# Altium schematic sheet ECUCheater.SCHDOC
size B
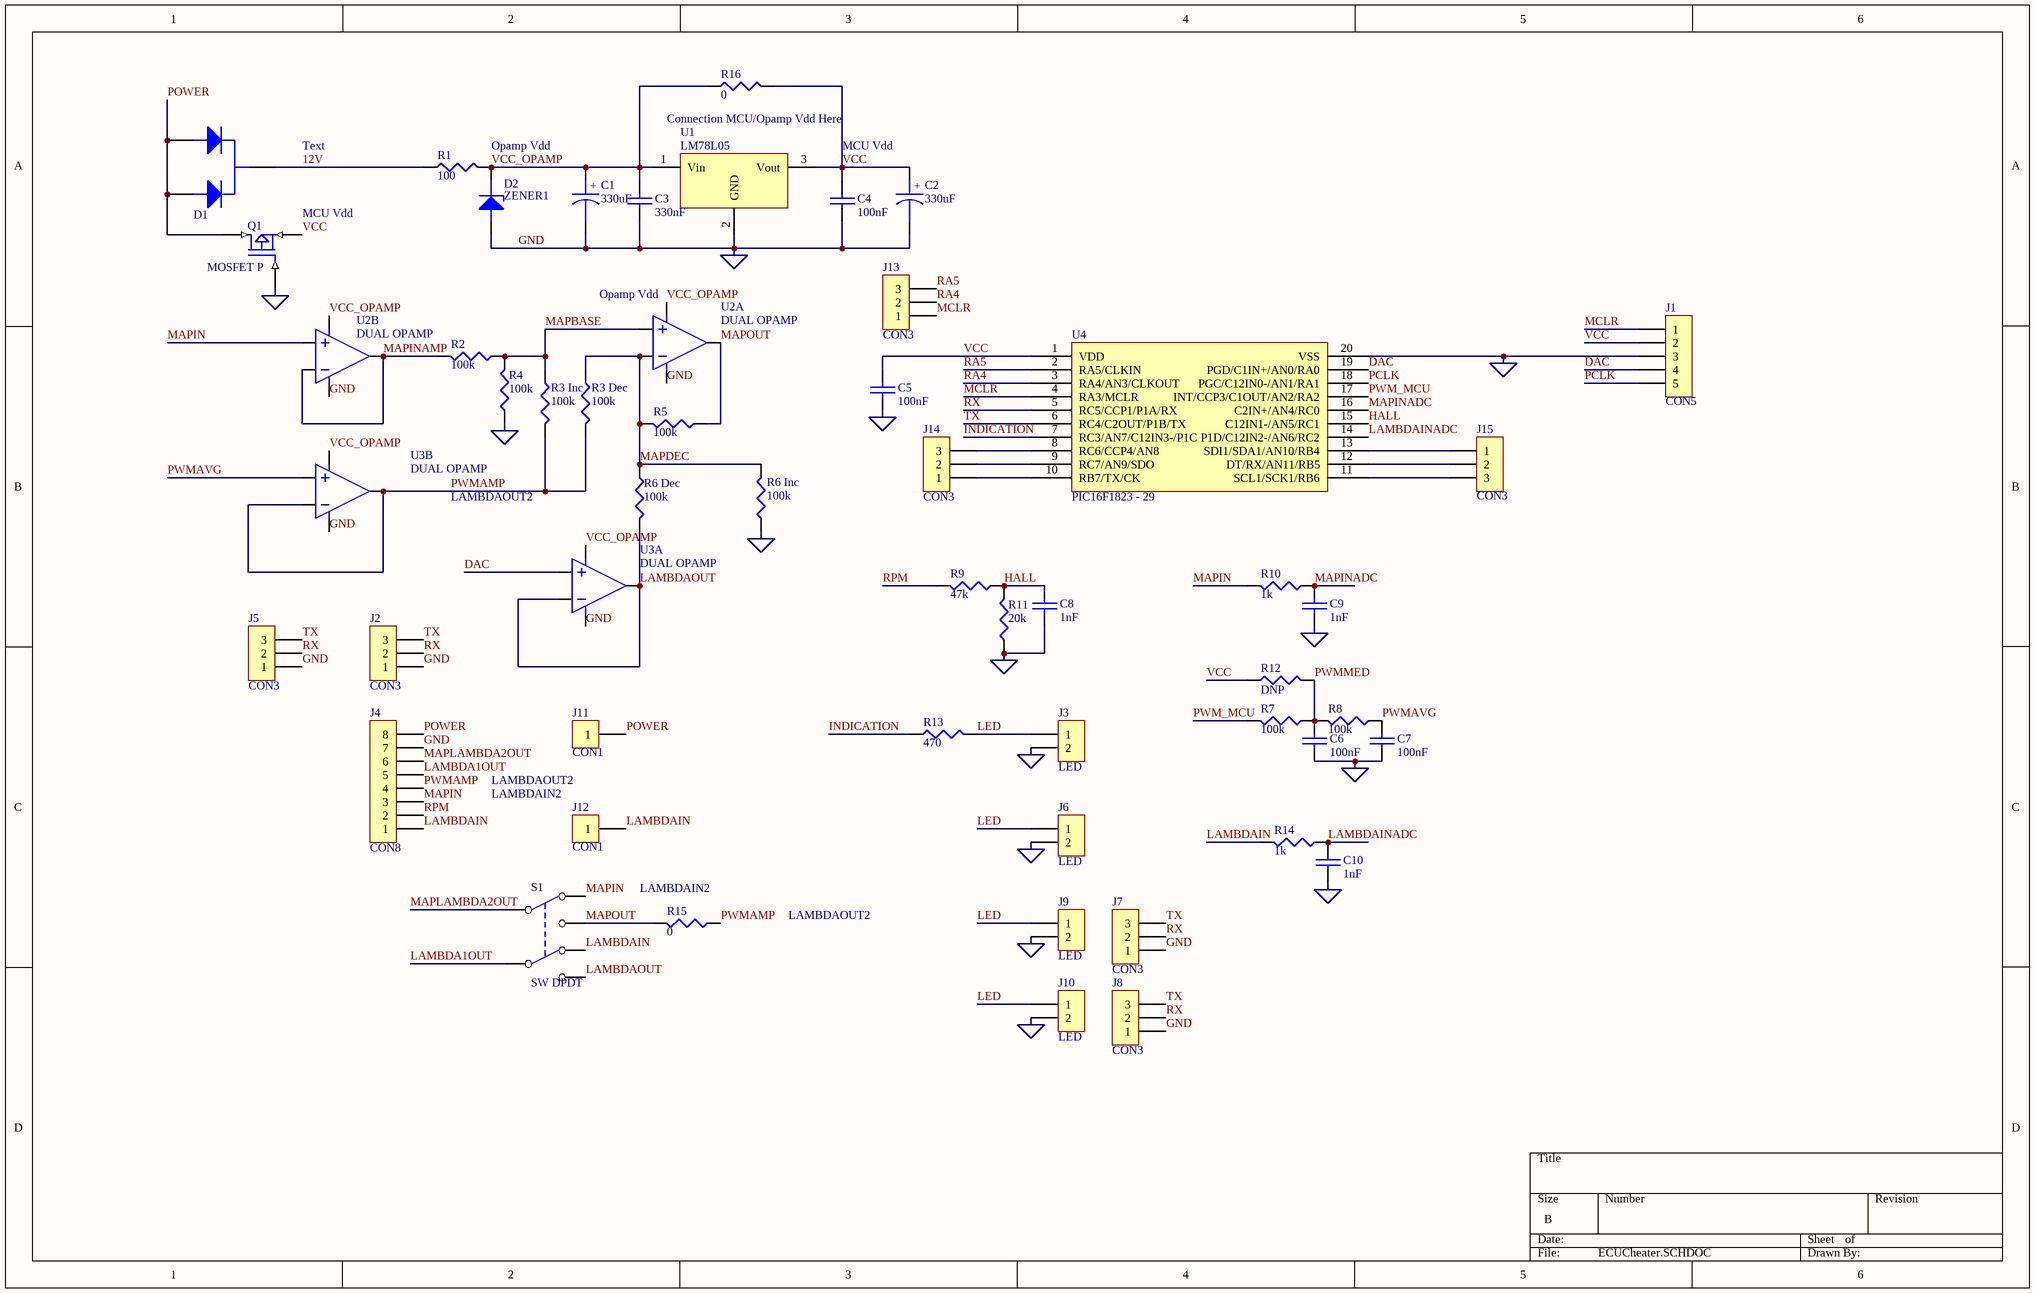
[diagram p0: ECUCheater.SCHDOC]

## Parts
C1  330uF  [3528 + RA 6.3mm NOT ROUND]
C2  330uF  [3528 + RA 6.3mm NOT ROUND]
C3  330nF  [0805]
C4  100nF  [0805]
C5  100nF  [0603 CAP]
C6  100nF  [0603 CAP]
C7  100nF  [0603 CAP]
C8  1nF  [0603 CAP]
C9  1nF  [0603 CAP]
C10  1nF  [0603 CAP]
D1  DUAL DIODE BAV70  [SOT-23]  (value not drawn)
D2  ZENER1  [SOT-23]
J1  CON5  [SIP5 - PGM]
J2  CON3  [SIP3]
J3  LED  [SIP2]
J4  CON8  [HD-351 8P]
J5  CON3  [SIP3]
J6  LED  [SIP2]
J7  CON3  [SIP3]
J8  CON3  [SIP3]
J9  LED  [SIP2]
J10  LED  [SIP2]
J11  CON1  [HD-351 1P]
J12  CON1  [HD-351 1P]
J13  CON3  [SIP3]
J14  CON3  [SIP3]
J15  CON3  [SIP3]
Q1  MOSFET P  [SOT-23]
R1  100  [0805]
R2  100k  [0603 RES]
R3_Dec  100k  [0603 RES]
R3_Inc  100k  [0603 RES]
R4  100k  [0603 RES]
R5  100k  [0603 RES]
R6_Dec  100k  [0603 RES]
R6_Inc  100k  [0603 RES]
R7  100k  [0603 RES]
R8  100k  [0603 RES]
R9  47k  [0603 RES]
R10  1k  [0603 RES]
R11  20k  [0603 RES]
R12  DNP  [0603 RES]
R13  470  [0603 RES]
R14  1k  [0603 RES]
R15  0  [0603 RES]
R16  0  [0805]
S1  SW DPDT  [BTN P1 ZIPPO]
U1  LM78L05  [SO-8 VOLTREG]
U2  DUAL OPAMP  [SO-8]  (parts A,B of 2)
U3  DUAL OPAMP  [SO-8]  (parts A,B of 2)
U4  PIC16F1823 - 29  [SOIC20W SO-14]

## Nets
GND: C1.2 C2.2 C3.2 C4.2 C5.2 C6.2 C7.2 C8.2 C9.2 C10.2 D2.1(A) J1.3 J2.1 J3.2 J4.7 J5.1 J6.2 J7.1 J8.1 J9.2 J10.2 Q1.1(G) R4.1 R6_Inc.1 R11.1 U1.2(GND) U2.4(V-) U3.4(V-) U4.20(VSS)  [also labelled SGND]
12V: D1.2(K) R1.1
DAC: J1.4 U3.3(IN+) U4.19(PGD/C1IN+/AN0/RA0)
HALL: C8.1 R9.1 R11.2 U4.15(C12IN1-/AN5/RC1)
INDICATION: R13.1 U4.7(RC3/AN7/C12IN3-/P1C)
LAMBDA1OUT: J4.5 S1.6(COMMON2)
LAMBDAIN: J4.1 J12.1 R14.2 S1.4(NC2)
LAMBDAINADC: C10.1 R14.1 U4.14(P1D/C12IN2-/AN6/RC2)
LAMBDAOUT: R6_Dec.2 S1.5(NO2) U3.1(OUT) U3.2(IN-)
LED: J3.1 J6.1 J9.1 J10.1 R13.2
MAPBASE: R2.1 R3_Inc.1 R4.2 U2.3(IN+)
MAPDEC: R3_Dec.1 R5.2 R6_Dec.1 R6_Inc.2 U2.2(IN-)
MAPIN: J4.3 R10.2 S1.1(NC1) U2.5(IN+)
MAPINADC: C9.1 R10.1 U4.16(C2IN+/AN4/RC0)
MAPINAMP: R2.2 U2.6(IN-) U2.7(OUT)
MAPLAMBDA2OUT: J4.6 S1.3(COMMON1)
MAPOUT: R5.1 R15.2 S1.2(NO1) U2.1(OUT)
MCLR: J1.1 J13.1 U4.4(RA3/MCLR)
PCLK: J1.5 U4.18(PGC/C12IN0-/AN1/RA1)
POWER: D1.1(A1) D1.3(A2) J4.8 J11.1 Q1.2(D)
PWM_MCU: R7.2 U4.17(INT/CCP3/C1OUT/AN2/RA2)
PWMAMP: J4.4 R3_Dec.2 R3_Inc.2 R15.1 U3.6(IN-) U3.7(OUT)
PWMAVG: C7.1 R8.1 U3.5(IN+)
PWMMED: C6.1 R7.1 R8.2 R12.2
RA4: J13.2 U4.3(RA4/AN3/CLKOUT)
RA5: J13.3 U4.2(RA5/CLKIN)
RPM: J4.2 R9.2
RX: J2.2 J5.2 J7.2 J8.2 U4.5(RC5/CCP1/P1A/RX)
TX: J2.3 J5.3 J7.3 J8.3 U4.6(RC4/C2OUT/P1B/TX)
VCC: C2.1 C4.1 C5.1 J1.2 Q1.3(S) R12.1 R16.2 U1.3(Vout) U4.1(VDD)
VCC_OPAMP: C1.1 C3.1 D2.2(K) R1.2 R16.1 U1.1(Vin) U2.8(V+) U3.8(V+)
NetJ14_1: J14.1 U4.10(RB7/TX/CK)
NetJ14_2: J14.2 U4.9(RC7/AN9/SDO)
NetJ14_3: J14.3 U4.8(RC6/CCP4/AN8)
NetJ15_1: J15.1 U4.13(SDI1/SDA1/AN10/RB4)
NetJ15_2: J15.2 U4.12(DT/RX/AN11/RB5)
NetJ15_3: J15.3 U4.11(SCL1/SCK1/RB6)

## Notes on the sheet
- Text
- Opamp Vdd
- Connection MCU/Opamp Vdd Here
- MCU Vdd
- (near Q1) MCU Vdd
- (near U2) Opamp Vdd
- LAMBDAOUT2
- LAMBDAIN2
- (near R15) LAMBDAIN2
- (in symbol CAPACITOR POL) +

## Library data of the parts
C1 C2 = CAPACITOR POL: Capacitor
C3-C10 = CAP: Capacitor
D2 = ZENER1: Zener Diode
J1 = CON5: Connector
J2 J5 J7 J8 J13-J15 = CON3: Connector
J3 J6 J9 J10 = CON2: Connector
J4 = CON8: Connector
J11 J12 = CON1: Connector
R1 R2 R3_Dec R3_Inc R4 R5 R6_Dec R6_Inc R7-R16 = RES1
U1 = VOLTREG
U4 = PIC16F1828: Microchip Microcontroller